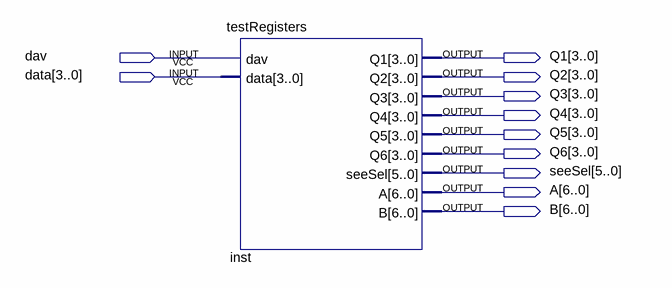
[diagram p0: schematic sheet]
// Quartus schematic testememoria.bdf as structural Verilog: 1 symbols, 11 pins
module testememoria (
  input  dav,
  input  [3:0] data,
  output [3:0] Q1,
  output [3:0] Q2,
  output [3:0] Q3,
  output [3:0] Q4,
  output [3:0] Q5,
  output [3:0] Q6,
  output [5:0] seeSel,
  output [6:0] A,
  output [6:0] B
);

  testRegisters inst (
    .dav(dav), .data(data), .Q1(Q1), .Q2(Q2), .Q3(Q3), .Q4(Q4), .Q5(Q5), .Q6(Q6), .seeSel(seeSel), .A(A),
    .B(B));
endmodule
